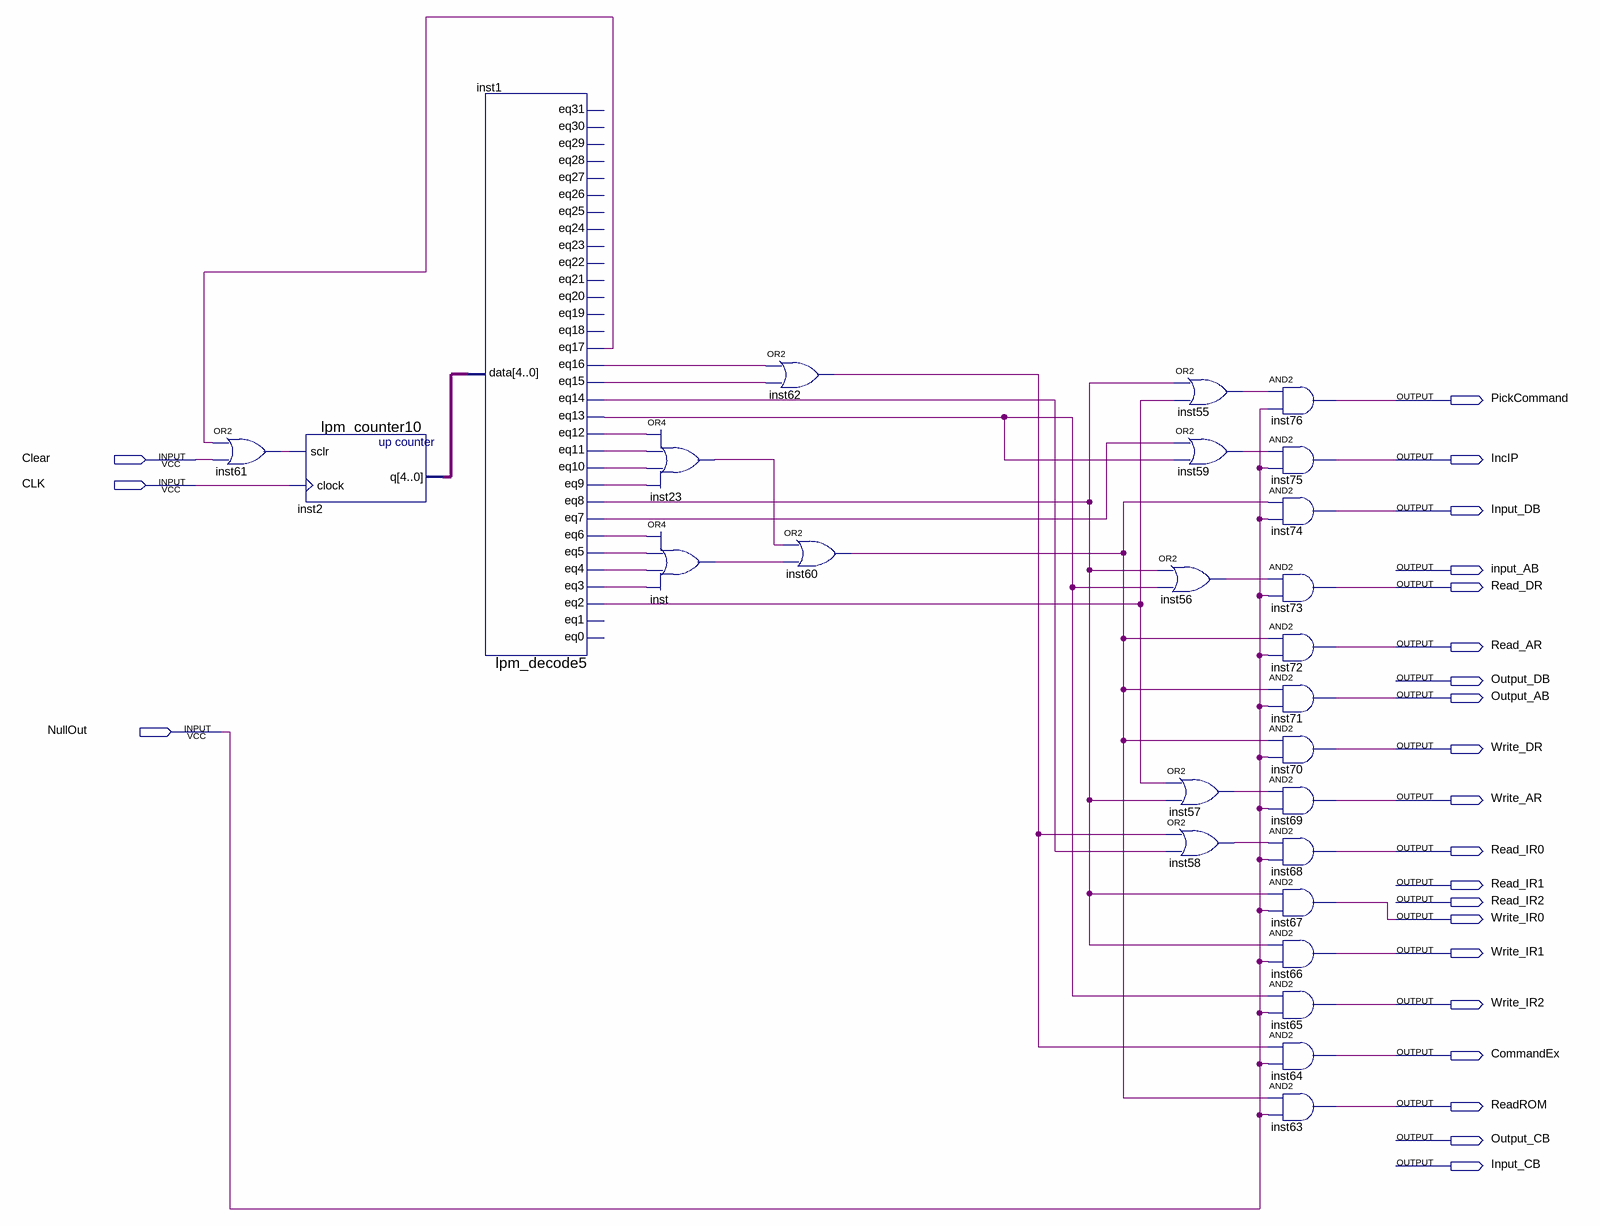
[diagram p0: schematic sheet]
// Quartus schematic InstructionCounter.bdf as structural Verilog: 26 symbols, 23 pins
module InstructionCounter (
  input  Clear,
  input  CLK,
  input  NullOut,
  output PickCommand,
  output IncIP,
  output Input_DB,
  output input_AB,
  output Read_DR,
  output Read_AR,
  output Output_DB,
  output Output_AB,
  output Write_DR,
  output Write_AR,
  output Read_IR0,
  output Read_IR1,
  output Read_IR2,
  output Write_IR0,
  output Write_IR1,
  output Write_IR2,
  output CommandEx,
  output ReadROM,
  output Output_CB,
  output Input_CB
);

  wire inst1_eq2, inst1_eq3, inst1_eq4, inst1_eq5, inst1_eq6, inst1_eq7, inst1_eq8, inst1_eq9, inst1_eq10,
       inst1_eq11, inst1_eq12, inst1_eq13, inst1_eq14, inst1_eq15, inst1_eq16, inst1_eq17, inst23_out,
       inst55_out, inst56_out, inst57_out, inst58_out, inst59_out, inst60_out, inst61_out, inst62_out,
       inst_out;
  wire [4:0] inst2_q;

  or inst61 (inst61_out, inst1_eq17, Clear);
  lpm_counter10 inst2 (.sclr(inst61_out), .clock(CLK), .q(inst2_q));
  lpm_decode5 inst1 (
    .data(inst2_q), .eq2(inst1_eq2), .eq3(inst1_eq3), .eq4(inst1_eq4), .eq5(inst1_eq5), .eq6(inst1_eq6),
    .eq7(inst1_eq7), .eq8(inst1_eq8), .eq9(inst1_eq9), .eq10(inst1_eq10), .eq11(inst1_eq11),
    .eq12(inst1_eq12), .eq13(inst1_eq13), .eq14(inst1_eq14), .eq15(inst1_eq15), .eq16(inst1_eq16),
    .eq17(inst1_eq17));  // open: eq0, eq1, eq18, eq19, eq20, eq21, eq22, eq23, eq24, eq25, eq26, eq27, eq28, eq29, eq30, eq31
  or inst23 (inst23_out, inst1_eq12, inst1_eq11, inst1_eq10, inst1_eq9);
  or inst (inst_out, inst1_eq6, inst1_eq5, inst1_eq4, inst1_eq3);
  or inst62 (inst62_out, inst1_eq16, inst1_eq15);
  or inst60 (inst60_out, inst23_out, inst_out);
  or inst55 (inst55_out, inst1_eq8, inst1_eq2);
  or inst59 (inst59_out, inst1_eq7, inst1_eq13);
  or inst56 (inst56_out, inst1_eq8, inst1_eq13);
  or inst57 (inst57_out, inst1_eq2, inst1_eq8);
  or inst58 (inst58_out, inst62_out, inst1_eq14);
  and inst76 (PickCommand, inst55_out, NullOut);
  and inst75 (IncIP, inst59_out, NullOut);
  and inst74 (Input_DB, inst60_out, NullOut);
  and inst73 (Read_DR, inst56_out, NullOut);
  and inst72 (Read_AR, inst60_out, NullOut);
  and inst71 (Output_AB, inst60_out, NullOut);
  and inst70 (Write_DR, inst60_out, NullOut);
  and inst69 (Write_AR, inst57_out, NullOut);
  and inst68 (Read_IR0, inst58_out, NullOut);
  and inst67 (Write_IR0, inst1_eq8, NullOut);
  and inst66 (Write_IR1, inst1_eq8, NullOut);
  and inst65 (Write_IR2, inst1_eq13, NullOut);
  and inst64 (CommandEx, inst62_out, NullOut);
  and inst63 (ReadROM, inst60_out, NullOut);
endmodule
